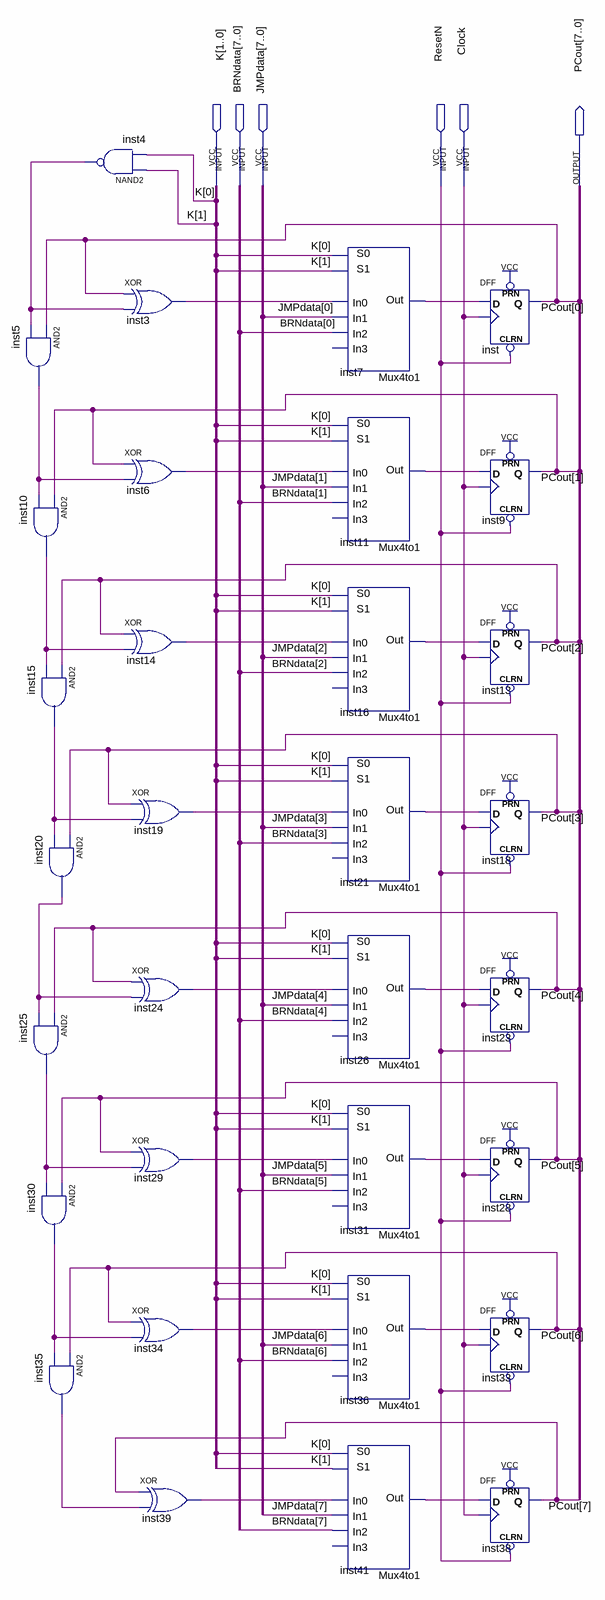
[diagram p0: schematic sheet]
// Quartus schematic ProgramCounter8Bit.bdf as structural Verilog: 32 symbols, 6 pins
module ProgramCounter8Bit (
  input  [1:0] K,
  input  [7:0] BRNdata,
  input  [7:0] JMPdata,
  input  ResetN,
  input  Clock,
  output [7:0] PCout
);

  wire inst3_out, inst4_out, inst5_out, inst6_out, inst7_out, inst10_out, inst11_out, inst14_out, inst15_out,
       inst16_out, inst19_out, inst20_out, inst21_out, inst24_out, inst25_out, inst26_out, inst29_out,
       inst30_out, inst31_out, inst34_out, inst35_out, inst36_out, inst39_out, inst41_out;

  and inst5 (inst5_out, PCout[0], inst4_out);
  and inst10 (inst10_out, PCout[1], inst5_out);
  and inst15 (inst15_out, PCout[2], inst10_out);
  and inst20 (inst20_out, PCout[3], inst15_out);
  and inst25 (inst25_out, PCout[4], inst20_out);
  and inst30 (inst30_out, PCout[5], inst25_out);
  and inst35 (inst35_out, PCout[6], inst30_out);
  nand inst4 (inst4_out, K[1], K[0]);
  xor inst3 (inst3_out, PCout[0], inst4_out);
  xor inst6 (inst6_out, PCout[1], inst5_out);
  xor inst14 (inst14_out, PCout[2], inst10_out);
  xor inst19 (inst19_out, PCout[3], inst15_out);
  xor inst24 (inst24_out, PCout[4], inst20_out);
  xor inst29 (inst29_out, PCout[5], inst25_out);
  xor inst34 (inst34_out, PCout[6], inst30_out);
  xor inst39 (inst39_out, PCout[7], inst35_out);
  Mux4to1 inst7 (
    .S0(K[0]), .S1(K[1]), .In0(inst3_out), .In1(JMPdata[0]), .In2(BRNdata[0]), .Out(inst7_out));  // open: In3
  Mux4to1 inst11 (
    .S0(K[0]), .S1(K[1]), .In0(inst6_out), .In1(JMPdata[1]), .In2(BRNdata[1]), .Out(inst11_out));  // open: In3
  Mux4to1 inst16 (
    .S0(K[0]), .S1(K[1]), .In0(inst14_out), .In1(JMPdata[2]), .In2(BRNdata[2]), .Out(inst16_out));  // open: In3
  Mux4to1 inst21 (
    .S0(K[0]), .S1(K[1]), .In0(inst19_out), .In1(JMPdata[3]), .In2(BRNdata[3]), .Out(inst21_out));  // open: In3
  Mux4to1 inst26 (
    .S0(K[0]), .S1(K[1]), .In0(inst24_out), .In1(JMPdata[4]), .In2(BRNdata[4]), .Out(inst26_out));  // open: In3
  Mux4to1 inst31 (
    .S0(K[0]), .S1(K[1]), .In0(inst29_out), .In1(JMPdata[5]), .In2(BRNdata[5]), .Out(inst31_out));  // open: In3
  Mux4to1 inst36 (
    .S0(K[0]), .S1(K[1]), .In0(inst34_out), .In1(JMPdata[6]), .In2(BRNdata[6]), .Out(inst36_out));  // open: In3
  Mux4to1 inst41 (
    .S0(K[0]), .S1(K[1]), .In0(inst39_out), .In1(JMPdata[7]), .In2(BRNdata[7]), .Out(inst41_out));  // open: In3
  DFF inst (.CLRN(ResetN), .CLK(Clock), .D(inst7_out), .PRN(1'b1), .Q(PCout[0]));
  DFF inst9 (.CLRN(ResetN), .CLK(Clock), .D(inst11_out), .PRN(1'b1), .Q(PCout[1]));
  DFF inst13 (.CLRN(ResetN), .CLK(Clock), .D(inst16_out), .PRN(1'b1), .Q(PCout[2]));
  DFF inst18 (.CLRN(ResetN), .CLK(Clock), .D(inst21_out), .PRN(1'b1), .Q(PCout[3]));
  DFF inst23 (.CLRN(ResetN), .CLK(Clock), .D(inst26_out), .PRN(1'b1), .Q(PCout[4]));
  DFF inst28 (.CLRN(ResetN), .CLK(Clock), .D(inst31_out), .PRN(1'b1), .Q(PCout[5]));
  DFF inst33 (.CLRN(ResetN), .CLK(Clock), .D(inst36_out), .PRN(1'b1), .Q(PCout[6]));
  DFF inst38 (.CLRN(ResetN), .CLK(Clock), .D(inst41_out), .PRN(1'b1), .Q(PCout[7]));
endmodule
